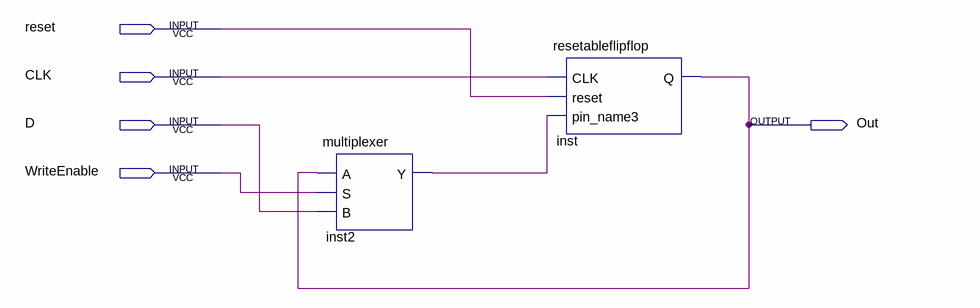
[diagram p0: schematic sheet]
// Quartus schematic writenableflipflop.bdf as structural Verilog: 2 symbols, 5 pins
module writenableflipflop (
  input  reset,
  input  CLK,
  input  D,
  input  WriteEnable,
  output Out
);

  wire inst2_y;

  multiplexer inst2 (.A(Out), .S(WriteEnable), .B(D), .Y(inst2_y));
  resetableflipflop inst (.CLK(CLK), .reset(reset), .pin_name3(inst2_y), .Q(Out));
endmodule
